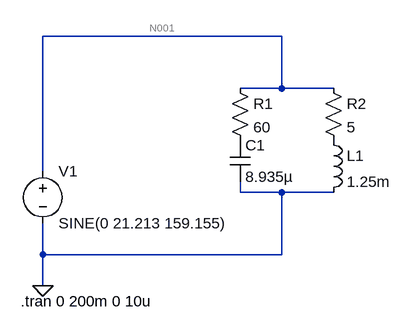
[diagram p0: schematic Схема8.asc]
Схема8.asc, the LTspice schematic file:
Version 4
SHEET 1 880 680
WIRE -1024 16 -1392 16
WIRE -1024 96 -1024 16
WIRE -1024 96 -1088 96
WIRE -944 96 -1024 96
WIRE -1392 224 -1392 16
WIRE -1088 256 -1088 240
WIRE -1024 256 -1088 256
WIRE -944 256 -1024 256
WIRE -1392 352 -1392 304
WIRE -1024 352 -1024 256
WIRE -1024 352 -1392 352
WIRE -1392 400 -1392 352
FLAG -1392 400 0
SYMBOL voltage -1392 208 R0
WINDOW 123 0 0 Left 0
WINDOW 39 0 0 Left 0
SYMATTR InstName V1
SYMATTR Value SINE(0 21.213 159.155)
SYMBOL res -960 80 R0
SYMATTR InstName R2
SYMATTR Value 5
SYMBOL ind -960 160 R0
SYMATTR InstName L1
SYMATTR Value 1.25m
SYMBOL res -1104 80 R0
SYMATTR InstName R1
SYMATTR Value 60
SYMBOL cap -1104 176 R0
SYMATTR InstName C1
SYMATTR Value 8.935µ
TEXT -1426 424 Left 2 !.tran 0 200m 0 10u

The netlist it stands for:
* Схема8.asc
V1 N001 0 SINE(0 21.213 159.155)
R2 N001 P001 5
L1 P001 0 1.25m
R1 N001 P002 60
C1 P002 0 8.935µ
.tran 0 200m 0 10u
.backanno
.end

* Results of the author's LTspice run, read from the files saved beside the schematic
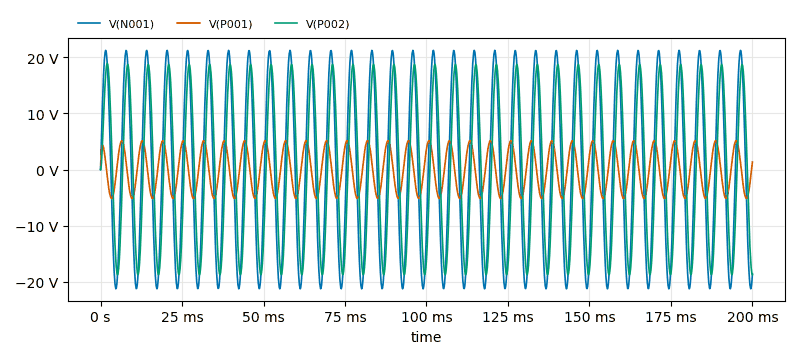
[diagram p1: Transient Analysis of Схема8.asc, plotted from the saved traces]
* Transient Analysis, 1 run:
*   V(N001): min -21.21 V, max 21.21 V, average 54.31 mV, rms 15 V, last -18.52 V
*   V(P001): min -5.144 V, max 5.144 V, average -24.81 mV, rms 3.633 V, last 1.338 V
*   V(P002): min -18.7 V, max 18.89 V, average 104.4 mV, rms 13.21 V, last -18.69 V